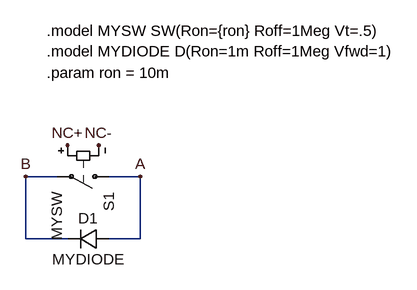
[diagram p0: schematic ss_sw.asc]
ss_sw.asc, the LTspice schematic file:
Version 4
SHEET 1 880 680
WIRE -128 128 -176 128
WIRE 0 128 -48 128
WIRE -176 224 -176 128
WIRE -112 224 -176 224
WIRE 0 224 0 128
WIRE 0 224 -48 224
FLAG -64 80 NC-
FLAG -112 80 NC+
FLAG -176 128 B
FLAG 0 128 A
SYMBOL sw -32 128 R90
SYMATTR InstName S1
SYMATTR Value MYSW
SYMBOL diode -48 208 R90
WINDOW 0 0 32 VBottom 2
WINDOW 3 32 32 VTop 2
SYMATTR InstName D1
SYMATTR Value MYDIODE
TEXT -144 -96 Left 2 !.model MYSW SW(Ron={ron} Roff=1Meg Vt=.5)\n.model MYDIODE D(Ron=1m Roff=1Meg Vfwd=1)
TEXT -144 -32 Left 2 !.param ron = 10m

The netlist it stands for:
* ss_sw.asc
S1 A B NC+ NC- MYSW
D1 A B MYDIODE
.model D D
.lib standard.dio
.model MYSW SW(Ron={ron} Roff=1Meg Vt=.5)
.model MYDIODE D(Ron=1m Roff=1Meg Vfwd=1)
.param ron = 10m
.backanno
.end